# Altium project BRK7360.PRJPCB
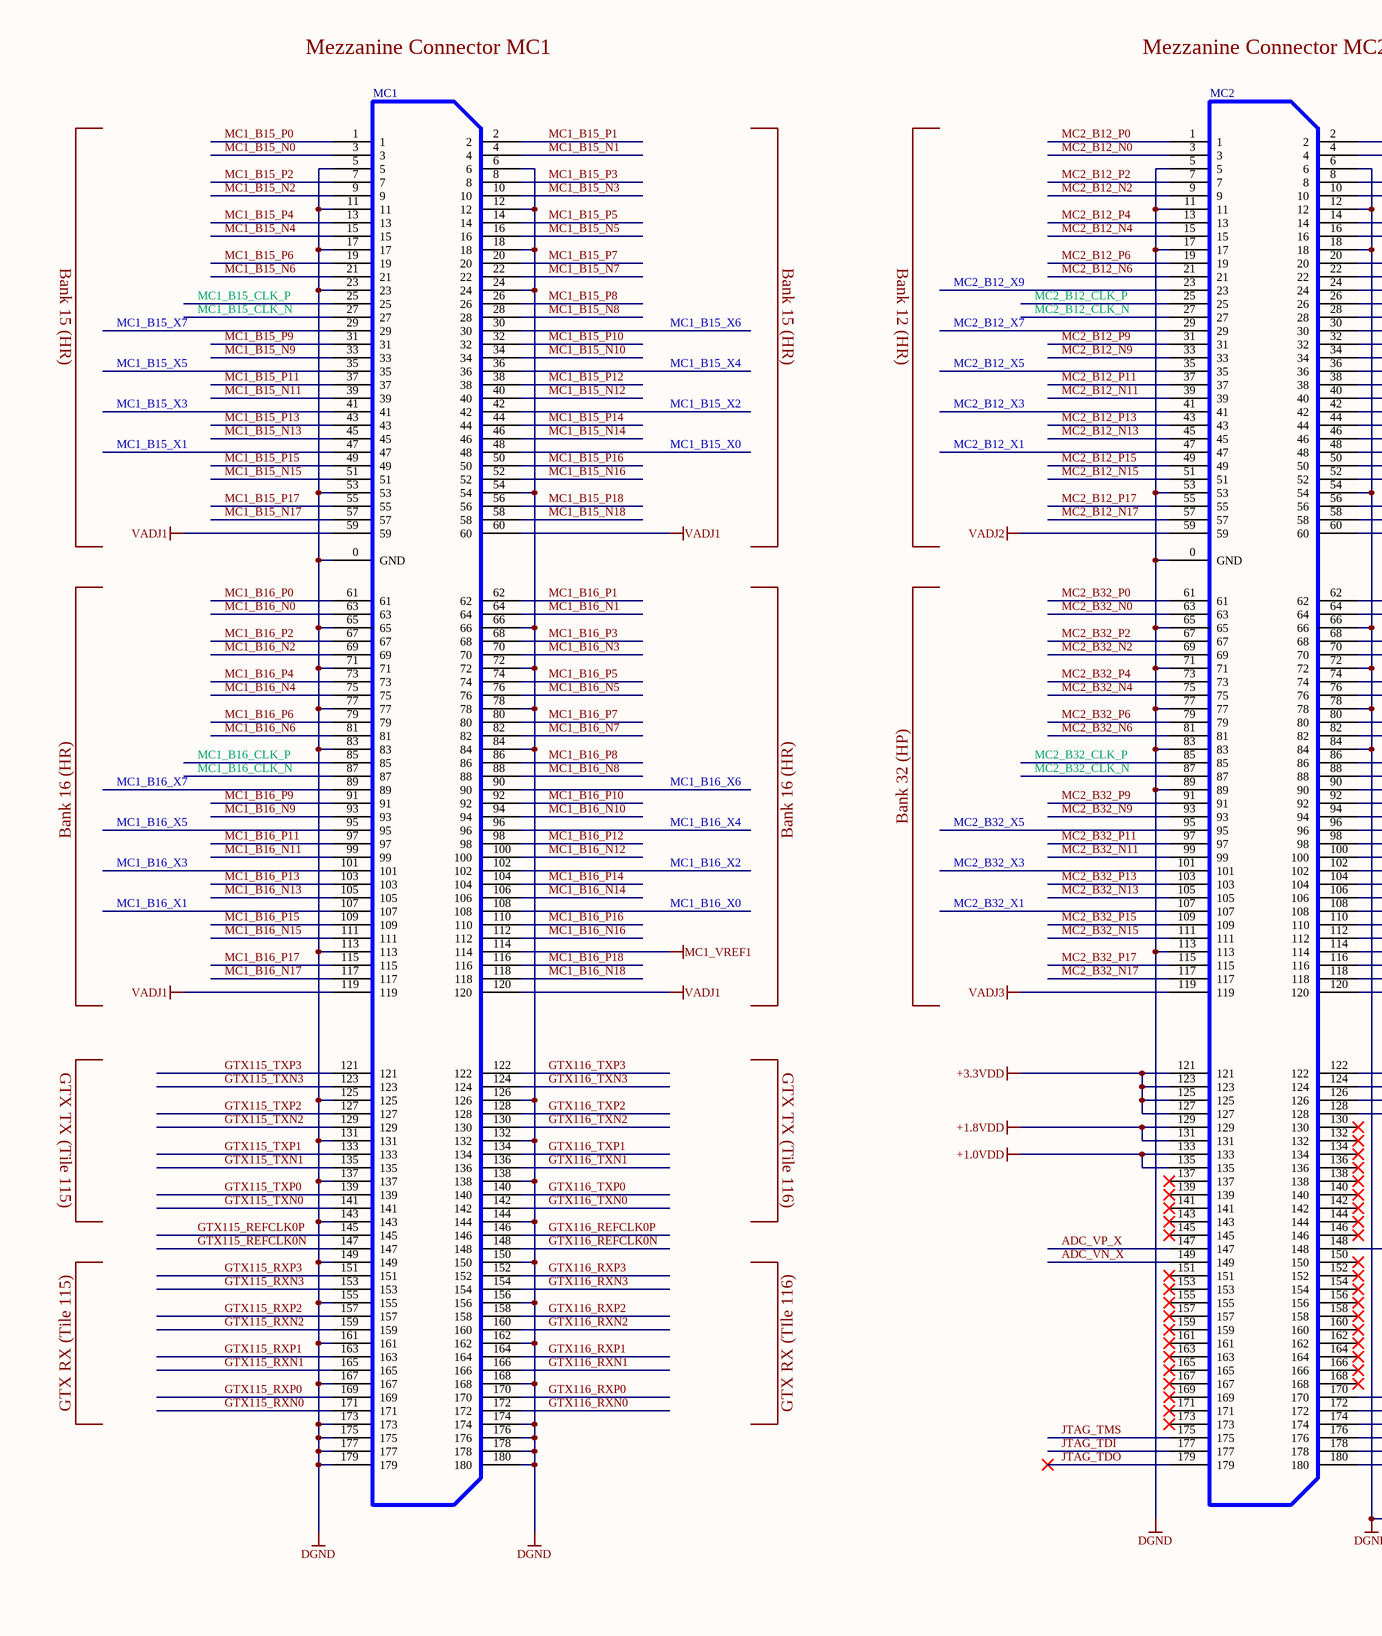
[diagram p0: Top.SchDoc, left]
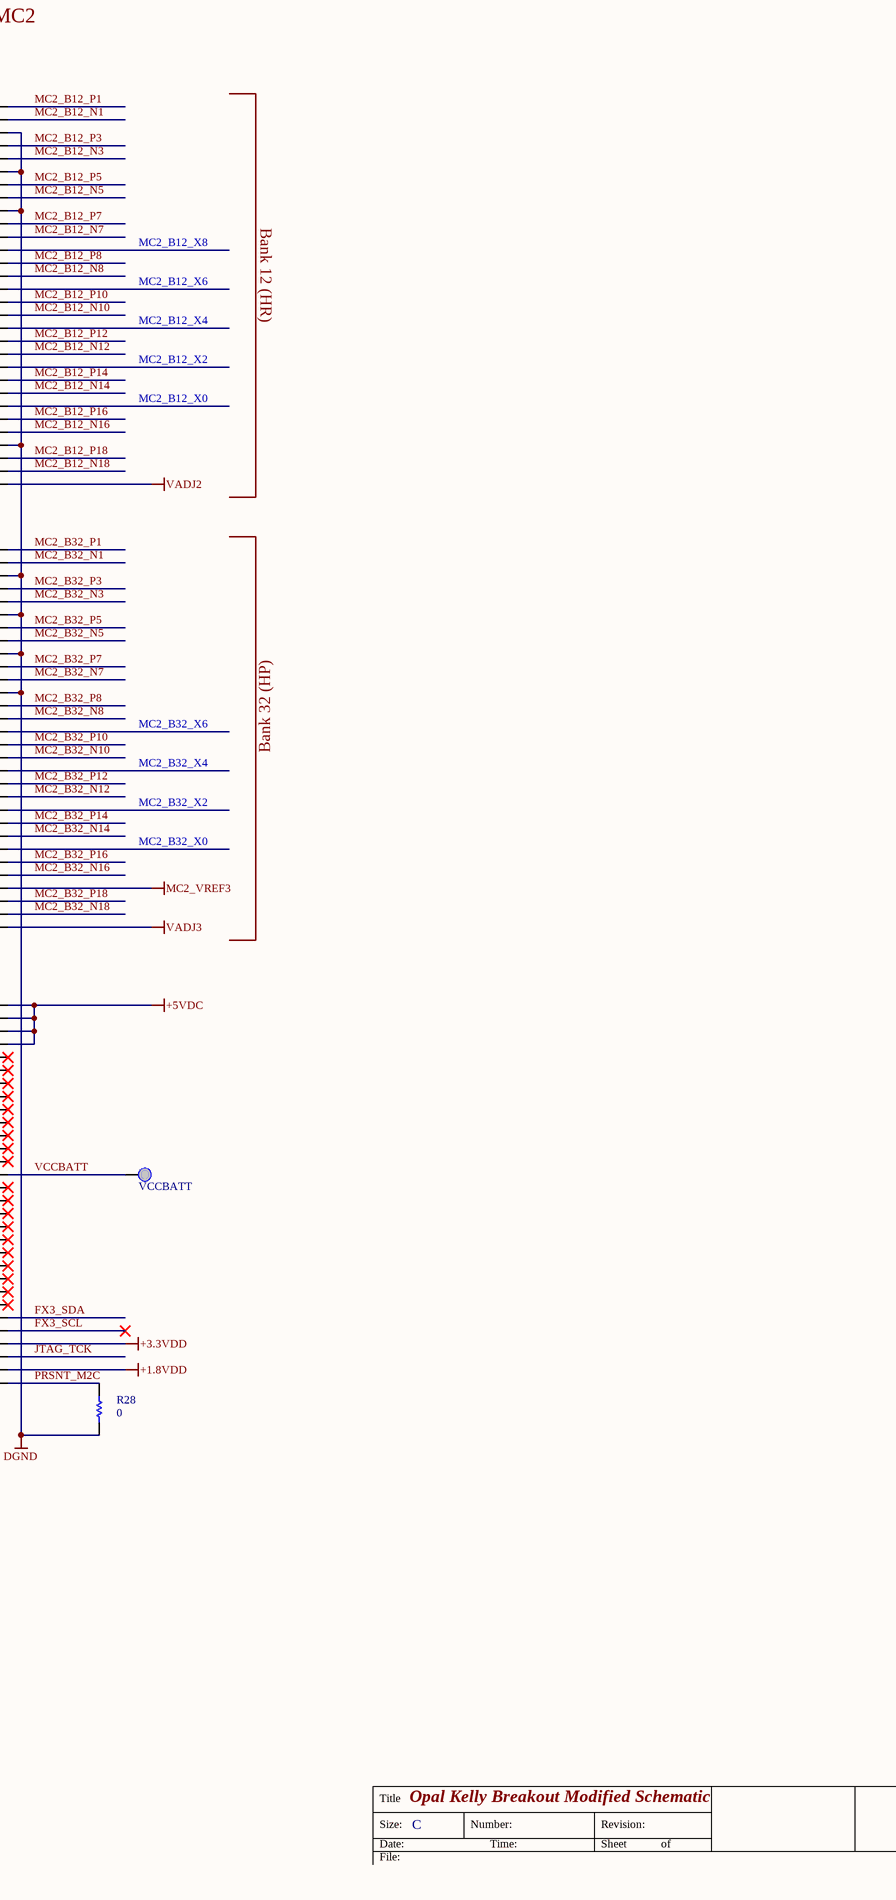
[diagram p1: Top.SchDoc, right]
3 sheets, 4 parts. Net scope: global (net labels, ports and power ports of the same name join across sheets).
Board file: BRK7360.PcbDoc
Sheets:
  Top.SchDoc
  MC1.SchDoc
  MC2.SchDoc

## Sheet Top.SchDoc: XEM7360 Breakout Board - Top
size C; DrawnBy: Nick Kettman; Organization: Opal Kelly; Address1: 13500 SW 72nd Ave Ste 100; Address2: Portland, OR 97223; Address4: http://www.opalkelly.com/; DocumentNumber: xxx; Revision: A; SheetNumber: 1; SheetTotal: 3; ProjectName: BRK7360

### Parts
MC1  QTH-090-01-F-D-A  [QTH-090-01-X-D]  (value not drawn)
MC2  QTH-090-01-F-D-A  [QTH-090-01-X-D]  (value not drawn)
R28  value 0  [RESC1608N]  (hidden comment: CRCW06030000Z0EA)
TP6  VCCBATT  [TP_MED]

### Nets
+1.0VDD: MC2.133 MC2.135
+1.8VDD: MC2.129 MC2.131 MC2.178
+3.3VDD: MC2.121 MC2.123 MC2.125 MC2.127 MC2.174
+5VDC: MC2.122 MC2.124 MC2.126 MC2.128
DGND: MC1.0(GND) MC1.5 MC1.6 MC1.11 MC1.12 MC1.17 MC1.18 MC1.23 MC1.24 MC1.53 MC1.54 MC1.65 MC1.66 MC1.71 MC1.72 MC1.77 MC1.78 MC1.83 MC1.84 MC1.113 MC1.125 MC1.126 MC1.131 MC1.132 MC1.137 MC1.138 MC1.143 MC1.144 MC1.149 MC1.150 MC1.155 MC1.156 MC1.161 MC1.162 MC1.167 MC1.168 MC1.173 MC1.174 MC1.175 MC1.176 MC1.177 MC1.178 MC1.179 MC1.180 MC2.0(GND) MC2.5 MC2.6 MC2.11 MC2.12 MC2.17 MC2.18 MC2.53 MC2.54 MC2.65 MC2.66 MC2.71 MC2.72 MC2.77 MC2.78 MC2.83 MC2.84 MC2.89 MC2.113 R28.1
MC1_VREF1: MC1.114
MC2_VREF3: MC2.114
VADJ1: MC1.59 MC1.60 MC1.119 MC1.120
VADJ2: MC2.59 MC2.60
VADJ3: MC2.119 MC2.120
ADC_VN_X: MC2.149
ADC_VP_X: MC2.147
FX3_SCL: MC2.172
FX3_SDA: MC2.170
GTX115_REFCLK0N: MC1.147
GTX115_REFCLK0P: MC1.145
GTX115_RXN0: MC1.171
GTX115_RXN1: MC1.165
GTX115_RXN2: MC1.159
GTX115_RXN3: MC1.153
GTX115_RXP0: MC1.169
GTX115_RXP1: MC1.163
GTX115_RXP2: MC1.157
GTX115_RXP3: MC1.151
GTX115_TXN0: MC1.141
GTX115_TXN1: MC1.135
GTX115_TXN2: MC1.129
GTX115_TXN3: MC1.123
GTX115_TXP0: MC1.139
GTX115_TXP1: MC1.133
GTX115_TXP2: MC1.127
GTX115_TXP3: MC1.121
GTX116_REFCLK0N: MC1.148
GTX116_REFCLK0P: MC1.146
GTX116_RXN0: MC1.172
GTX116_RXN1: MC1.166
GTX116_RXN2: MC1.160
GTX116_RXN3: MC1.154
GTX116_RXP0: MC1.170
GTX116_RXP1: MC1.164
GTX116_RXP2: MC1.158
GTX116_RXP3: MC1.152
GTX116_TXN0: MC1.142
GTX116_TXN1: MC1.136
GTX116_TXN2: MC1.130
GTX116_TXN3: MC1.124
GTX116_TXP0: MC1.140
GTX116_TXP1: MC1.134
GTX116_TXP2: MC1.128
GTX116_TXP3: MC1.122
JTAG_TCK: MC2.176
JTAG_TDI: MC2.177
JTAG_TDO: MC2.179
JTAG_TMS: MC2.175
MC1_B15_CLK_N: MC1.27
MC1_B15_CLK_P: MC1.25
MC1_B15_N0: MC1.3
MC1_B15_N1: MC1.4
MC1_B15_N2: MC1.9
MC1_B15_N3: MC1.10
MC1_B15_N4: MC1.15
MC1_B15_N5: MC1.16
MC1_B15_N6: MC1.21
MC1_B15_N7: MC1.22
MC1_B15_N8: MC1.28
MC1_B15_N9: MC1.33
MC1_B15_N10: MC1.34
MC1_B15_N11: MC1.39
MC1_B15_N12: MC1.40
MC1_B15_N13: MC1.45
MC1_B15_N14: MC1.46
MC1_B15_N15: MC1.51
MC1_B15_N16: MC1.52
MC1_B15_N17: MC1.57
MC1_B15_N18: MC1.58
MC1_B15_P0: MC1.1
MC1_B15_P1: MC1.2
MC1_B15_P2: MC1.7
MC1_B15_P3: MC1.8
MC1_B15_P4: MC1.13
MC1_B15_P5: MC1.14
MC1_B15_P6: MC1.19
MC1_B15_P7: MC1.20
MC1_B15_P8: MC1.26
MC1_B15_P9: MC1.31
MC1_B15_P10: MC1.32
MC1_B15_P11: MC1.37
MC1_B15_P12: MC1.38
MC1_B15_P13: MC1.43
MC1_B15_P14: MC1.44
MC1_B15_P15: MC1.49
MC1_B15_P16: MC1.50
MC1_B15_P17: MC1.55
MC1_B15_P18: MC1.56
MC1_B15_X0: MC1.48
MC1_B15_X1: MC1.47
MC1_B15_X2: MC1.42
MC1_B15_X3: MC1.41
MC1_B15_X4: MC1.36
MC1_B15_X5: MC1.35
MC1_B15_X6: MC1.30
MC1_B15_X7: MC1.29
MC1_B16_CLK_N: MC1.87
MC1_B16_CLK_P: MC1.85
MC1_B16_N0: MC1.63
MC1_B16_N1: MC1.64
MC1_B16_N2: MC1.69
MC1_B16_N3: MC1.70
MC1_B16_N4: MC1.75
MC1_B16_N5: MC1.76
MC1_B16_N6: MC1.81
MC1_B16_N7: MC1.82
MC1_B16_N8: MC1.88
MC1_B16_N9: MC1.93
MC1_B16_N10: MC1.94
MC1_B16_N11: MC1.99
MC1_B16_N12: MC1.100
MC1_B16_N13: MC1.105
MC1_B16_N14: MC1.106
MC1_B16_N15: MC1.111
MC1_B16_N16: MC1.112
MC1_B16_N17: MC1.117
MC1_B16_N18: MC1.118
MC1_B16_P0: MC1.61
MC1_B16_P1: MC1.62
MC1_B16_P2: MC1.67
MC1_B16_P3: MC1.68
MC1_B16_P4: MC1.73
MC1_B16_P5: MC1.74
MC1_B16_P6: MC1.79
MC1_B16_P7: MC1.80
MC1_B16_P8: MC1.86
MC1_B16_P9: MC1.91
MC1_B16_P10: MC1.92
MC1_B16_P11: MC1.97
MC1_B16_P12: MC1.98
MC1_B16_P13: MC1.103
MC1_B16_P14: MC1.104
MC1_B16_P15: MC1.109
MC1_B16_P16: MC1.110
MC1_B16_P17: MC1.115
MC1_B16_P18: MC1.116
MC1_B16_X0: MC1.108
MC1_B16_X1: MC1.107
MC1_B16_X2: MC1.102
MC1_B16_X3: MC1.101
MC1_B16_X4: MC1.96
MC1_B16_X5: MC1.95
MC1_B16_X6: MC1.90
MC1_B16_X7: MC1.89
MC2_B12_CLK_N: MC2.27
MC2_B12_CLK_P: MC2.25
MC2_B12_N0: MC2.3
MC2_B12_N1: MC2.4
MC2_B12_N2: MC2.9
MC2_B12_N3: MC2.10
MC2_B12_N4: MC2.15
MC2_B12_N5: MC2.16
MC2_B12_N6: MC2.21
MC2_B12_N7: MC2.22
MC2_B12_N8: MC2.28
MC2_B12_N9: MC2.33
MC2_B12_N10: MC2.34
MC2_B12_N11: MC2.39
MC2_B12_N12: MC2.40
MC2_B12_N13: MC2.45
MC2_B12_N14: MC2.46
MC2_B12_N15: MC2.51
MC2_B12_N16: MC2.52
MC2_B12_N17: MC2.57
MC2_B12_N18: MC2.58
MC2_B12_P0: MC2.1
MC2_B12_P1: MC2.2
MC2_B12_P2: MC2.7
MC2_B12_P3: MC2.8
MC2_B12_P4: MC2.13
MC2_B12_P5: MC2.14
MC2_B12_P6: MC2.19
MC2_B12_P7: MC2.20
MC2_B12_P8: MC2.26
MC2_B12_P9: MC2.31
MC2_B12_P10: MC2.32
MC2_B12_P11: MC2.37
MC2_B12_P12: MC2.38
MC2_B12_P13: MC2.43
MC2_B12_P14: MC2.44
MC2_B12_P15: MC2.49
MC2_B12_P16: MC2.50
MC2_B12_P17: MC2.55
MC2_B12_P18: MC2.56
MC2_B12_X0: MC2.48
MC2_B12_X1: MC2.47
MC2_B12_X2: MC2.42
MC2_B12_X3: MC2.41
MC2_B12_X4: MC2.36
MC2_B12_X5: MC2.35
MC2_B12_X6: MC2.30
MC2_B12_X7: MC2.29
MC2_B12_X8: MC2.24
MC2_B12_X9: MC2.23
MC2_B32_CLK_N: MC2.87
MC2_B32_CLK_P: MC2.85
MC2_B32_N0: MC2.63
MC2_B32_N1: MC2.64
MC2_B32_N2: MC2.69
MC2_B32_N3: MC2.70
MC2_B32_N4: MC2.75
MC2_B32_N5: MC2.76
MC2_B32_N6: MC2.81
MC2_B32_N7: MC2.82
MC2_B32_N8: MC2.88
MC2_B32_N9: MC2.93
MC2_B32_N10: MC2.94
MC2_B32_N11: MC2.99
MC2_B32_N12: MC2.100
MC2_B32_N13: MC2.105
MC2_B32_N14: MC2.106
MC2_B32_N15: MC2.111
MC2_B32_N16: MC2.112
MC2_B32_N17: MC2.117
MC2_B32_N18: MC2.118
MC2_B32_P0: MC2.61
MC2_B32_P1: MC2.62
MC2_B32_P2: MC2.67
MC2_B32_P3: MC2.68
MC2_B32_P4: MC2.73
MC2_B32_P5: MC2.74
MC2_B32_P6: MC2.79
MC2_B32_P7: MC2.80
MC2_B32_P8: MC2.86
MC2_B32_P9: MC2.91
MC2_B32_P10: MC2.92
MC2_B32_P11: MC2.97
MC2_B32_P12: MC2.98
MC2_B32_P13: MC2.103
MC2_B32_P14: MC2.104
MC2_B32_P15: MC2.109
MC2_B32_P16: MC2.110
MC2_B32_P17: MC2.115
MC2_B32_P18: MC2.116
MC2_B32_X0: MC2.108
MC2_B32_X1: MC2.107
MC2_B32_X2: MC2.102
MC2_B32_X3: MC2.101
MC2_B32_X4: MC2.96
MC2_B32_X5: MC2.95
MC2_B32_X6: MC2.90
PRSNT_M2C: MC2.180 R28.2
VCCBATT: MC2.148 TP6.1(PIN)

Not connected (* = marked no-connect by the designer): MC2 130* 132* 134* 136* 137* 138* 139* 140* 141* 142* 143* 144* 145* 146* 150* 151* 152* 153* 154* 155* 156* 157* 158* 159* 160* 161* 162* 163* 164* 165* 166* 167* 168* 169* 171* 173*

### Notes on the sheet
- Mezzanine Connector MC1
- Mezzanine Connector MC2
- Bank 15 (HR)
- Bank 12 (HR)
- Bank 16 (HR)
- Bank 32 (HP)
- GTX TX (Tile 115)
- GTX TX (Tile 116)
- GTX RX (Tile 115)
- GTX RX (TIle 116)
- Title
- Size:
- Date:
- File:
- Opal Kelly Breakout Modified Schematic
- C
- Number:
- Time:
- Revision:
- Sheet
- of

### Library data of the parts
MC1 MC2 = 000876: 0.5mm hi-speed, high-density header (Female); Manufacturer: Samtec; partnumber: 000876; Description 2: 180-pin, ground plane in middle; Manufacturer_PN: QTH-090-01-F-D-A; updated_on: 3/23/2015 1:16:30 PM
R28 = 000411: Zero-ohm resistor; Manufacturer: Vishay; partnumber: 000411; Description 2: SM-0603, 1/10W, 20 mOhm max; Manufacturer_PN: CRCW06030000Z0EA; ValueFloat: 0; updated_on: 2/12/2015 9:26:27 AM
TP6 = 000265: Testpoint; Manufacturer: Keystone Electronics; Manufacturer_PN: 5007; partnumber: 000265; Description 2: 0.063 in. diameter, compact, White; updated_on: 1/24/2015 12:30:04 PM; NoLoad: NoLoad

## Sheet MC1.SchDoc: XEM7360 Breakout Board - MC1
size C; Author: Nick Kettman; Organization: Opal Kelly; Address1: 13500 SW 72nd Ave Ste 100; Address2: Portland, OR 97223; Address4: http://www.opalkelly.com; DocumentNumber: xxx; Revision: 1; SheetNumber: 2; SheetTotal: 3; PageSetup: Record=PageOptions|CenterHorizontal=True|CenterVertical=True|PrintScale=0.53|XCorrection=1.00|YCorrection=1.00|PrintKind=0|BorderSize=5000000|LeftOffset=0|BottomOffset=0|Orientation=2|PaperLength=1000|PaperWidth=1000|Scale=100|PaperSource=7|PrintQuality=-4|MediaType=1|DitherType=10|PaperKind=Letter|PrintScaleMode=1
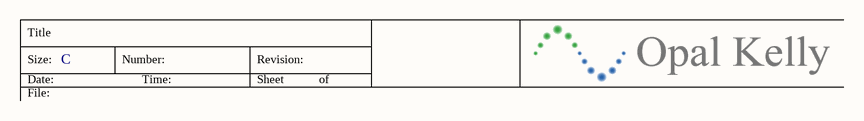
[diagram p2: MC1.SchDoc]

### Notes on the sheet
- Title
- Size:
- Date:
- File:
- C
- Number:
- Time:
- Revision:
- Sheet
- of

## Sheet MC2.SchDoc: XEM7360 Breakout Board - MC2
size C; Author: Nick Kettman; Organization: Opal Kelly; Address1: 13500 SW 72nd Ave Ste 100; Address2: Portland, OR 97223; Address4: http://www.opalkelly.com; DocumentNumber: xxx; Revision: 1; SheetNumber: 3; SheetTotal: 3; PageSetup: Record=PageOptions|CenterHorizontal=True|CenterVertical=True|PrintScale=0.53|XCorrection=1.00|YCorrection=1.00|PrintKind=0|BorderSize=5000000|LeftOffset=0|BottomOffset=0|Orientation=2|PaperLength=1000|PaperWidth=1000|Scale=100|PaperSource=7|PrintQuality=-4|MediaType=1|DitherType=10|PaperKind=Letter|PrintScaleMode=1
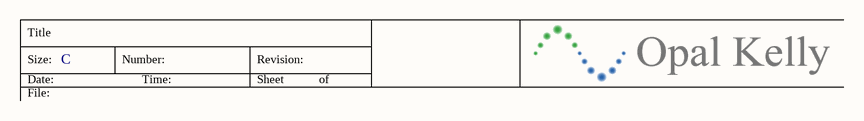
[diagram p3: MC2.SchDoc]

### Notes on the sheet
- Title
- Size:
- Date:
- File:
- C
- Number:
- Time:
- Revision:
- Sheet
- of